# Altium schematic sheet Ethernet.SchDoc: Motor Vibration
size A4; Organization: NTUST EE-305; Address1: No.43, Sec. 4, Keelung Rd.; Address2: Da’an Dist.; Address3: Taipei 106; Address4: Taiwan (R.O.C.); DocumentNumber: 1; Revision: 3.0; SheetNumber: 2; SheetTotal: 9
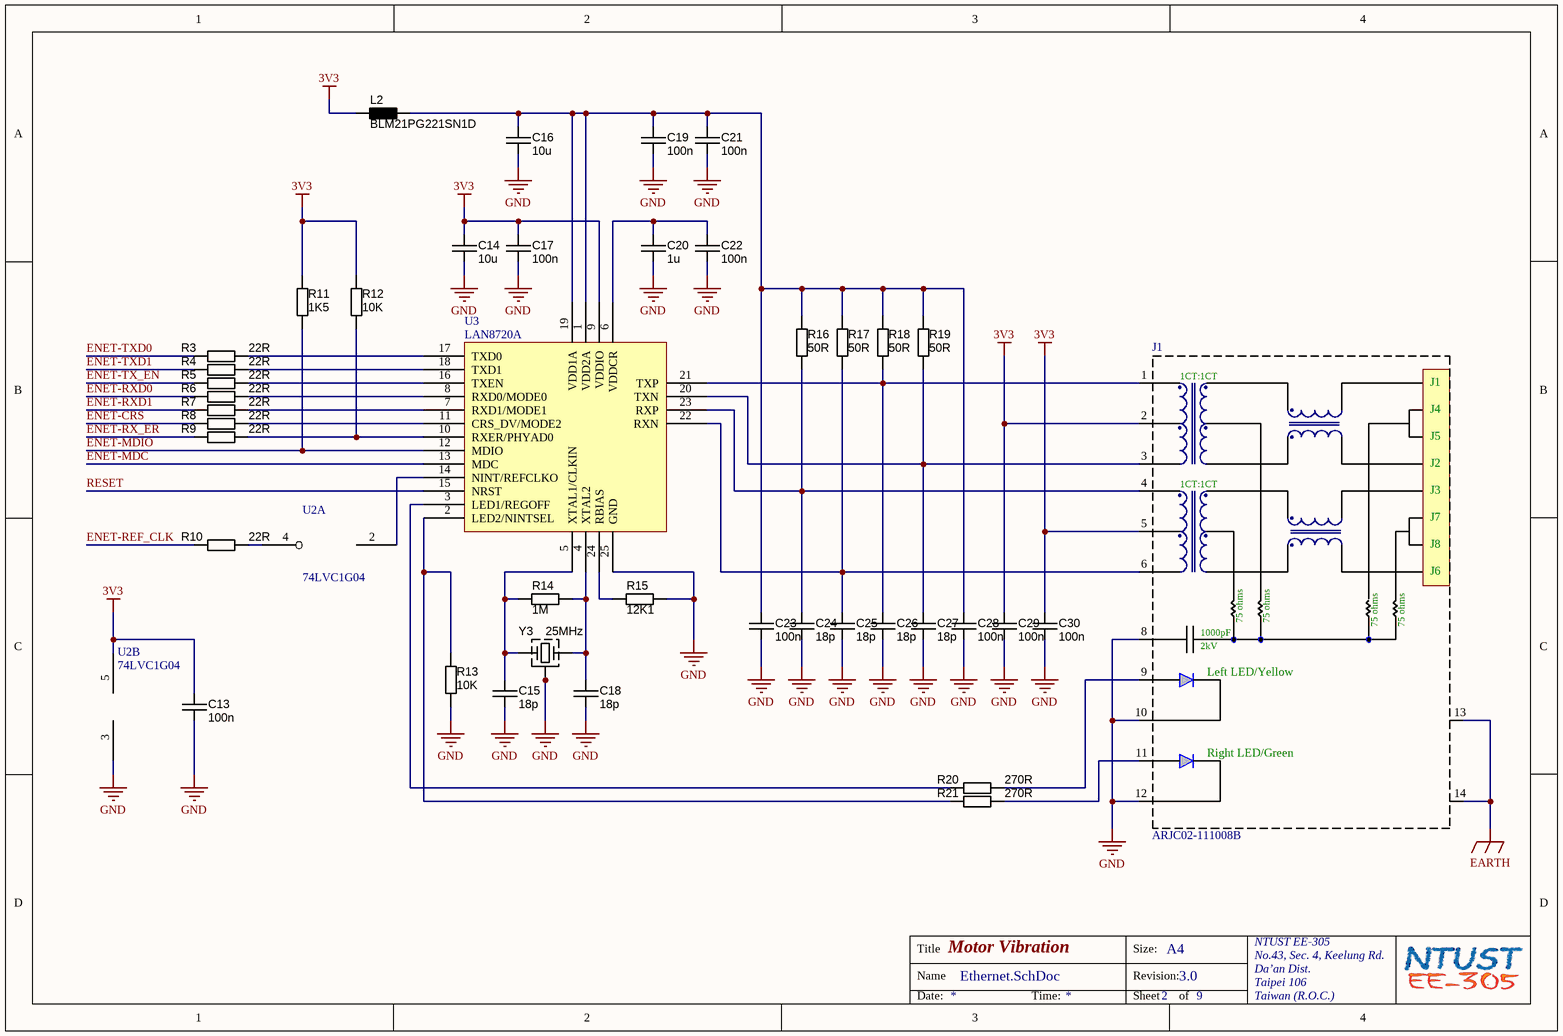
[diagram p0: Ethernet.SchDoc]

## Parts
C13  100n  [CAPC1005N]
C14  10u  [CAPC2012N]
C15  18p  [CAPC1005N]
C16  10u  [CAPC2012N]
C17  100n  [CAPC1005N]
C18  18p  [CAPC1005N]
C19  100n  [CAPC1005N]
C20  1u  [CAPC1608N]
C21  100n  [CAPC1005N]
C22  100n  [CAPC1005N]
C23  100n  [CAPC1005N]
C24  18p  [CAPC1005N]
C25  18p  [CAPC1005N]
C26  18p  [CAPC1005N]
C27  18p  [CAPC1005N]
C28  100n  [CAPC1005N]
C29  100n  [CAPC1005N]
C30  100n  [CAPC1005N]
J1  ARJC02-111008B  [ARJC02-111008B]
L2  BLM21PG221SN1D  [INDC2012N]
R3  22R  [RESC1005N]
R4  22R  [RESC1005N]
R5  22R  [RESC1005N]
R6  22R  [RESC1005N]
R7  22R  [RESC1005N]
R8  22R  [RESC1005N]
R9  22R  [RESC1005N]
R10  22R  [RESC1005N]
R11  1K5  [RESC1005N]
R12  10K  [RESC1005N]
R13  10K  [RESC1005N]
R14  1M  [RESC1005N]
R15  12K1  [RESC1005N]
R16  50R  [RESC1005N]
R17  50R  [RESC1005N]
R18  50R  [RESC1005N]
R19  50R  [RESC1005N]
R20  270R  [RESC1005N]
R21  270R  [RESC1005N]
U2  74LVC1G04  [SC70-LT5_N]  (parts A,B of 2)
U3  LAN8720A  [QFN-MJ24]
Y3  25MHz  [4SMD]

## Nets
3V3: C13.1 C14.1 C17.1 C29.1 C30.1 J1.2(CTD) J1.5(CRD) L2.1 R11.1 R12.1 U2.5(VCC) U3.9(VDDIO)
EARTH: J1.13(GND) J1.14(GND)
GND: C13.2 C14.2 C15.2 C16.2 C17.2 C18.2 C19.2 C20.2 C21.2 C22.2 C23.2 C24.2 C25.2 C26.2 C27.2 C28.2 C29.2 C30.2 J1.8(Shield) J1.10 J1.12 R13.2 R15.2 U2.3(GND) U3.25(GND) Y3.2(GND) Y3.4(GND)
ENET-CRS: R8.1
ENET-MDC: U3.13(MDC)
ENET-MDIO: R11.2 U3.12(MDIO)
ENET-REF_CLK: R10.1
ENET-RX_ER: R9.1
ENET-RXD0: R6.1
ENET-RXD1: R7.1
ENET-TX_EN: R5.1
ENET-TXD0: R3.1
ENET-TXD1: R4.1
RESET: U3.15(NRST)
NetC15_1: C15.1 R14.1 U3.5(XTAL1/CLKIN) Y3.1(X)
NetC16_1: C16.1 C19.1 C21.1 C23.1 C28.1 L2.2 R16.1 R17.1 R18.1 R19.1 U3.1(VDD2A) U3.19(VDD1A)
NetC18_1: C18.1 R14.2 U3.4(XTAL2) Y3.3(X)
NetC20_1: C20.1 C22.1 U3.6(VDDCR)
NetC24_1: C24.1 J1.4(RD+) R16.2 U3.23(RXP)
NetC25_1: C25.1 J1.6(RD-) R17.2 U3.22(RXN)
NetC26_1: C26.1 J1.1(TD+) R18.2 U3.21(TXP)
NetC27_1: C27.1 J1.3(TD-) R19.2 U3.20(TXN)
NetJ1_9: J1.9 R20.2
NetJ1_11: J1.11 R21.2
NetR3_2: R3.2 U3.17(TXD0)
NetR4_2: R4.2 U3.18(TXD1)
NetR5_2: R5.2 U3.16(TXEN)
NetR6_2: R6.2 U3.8(RXD0/MODE0)
NetR7_2: R7.2 U3.7(RXD1/MODE1)
NetR8_2: R8.2 U3.11(CRS_DV/MODE2)
NetR9_2: R9.2 R12.2 U3.10(RXER/PHYAD0)
NetR10_2: R10.2 U2.4
NetR13_1: R13.1 R21.1 U3.2(LED2/NINTSEL)
NetR15_1: R15.1 U3.24(RBIAS)
NetR20_1: R20.1 U3.3(LED1/REGOFF)
NetU2_2: U2.2 U3.14(NINT/REFCLKO)

## Notes on the sheet
- Title
- Name
- Size:
- Revision:
- A4
- Date:
- Time:
- Sheet
- of
- (in symbol ARJC02-111008B) 1CT:1CT; J4; J5; J2; J3; J7; J8; J6; 75 ohms; 1000pF; 2kV; Left LED/Yellow; Right LED/Green

## Library data of the parts
C13 C14 C16 C17 C19-C23 C28-C30 = Capacitor SMD Cer X7R: Manufacturer 1: Kemet; Manufacturer Part Number 1: C0805C104K5RACTU; Tolerance: ?0%; Ratings: 50V; X7R; Material: ceramic; Package / Case: 0805 (2012 metric); Supplier 1: Digi-Key; Supplier Part Number 1: 399-1170-1-ND
  C13 C17 C19 C21-C23 C28-C30: Value: 100n
  C14 C16: Value: 10u
  C20: Value: 1u
C15 C18 C24-C27 = Capacitor SMD Cer NPO: Manufacturer 1: Kemet; Manufacturer Part Number 1: C0805C104K5RACTU; Tolerance: ?0%; Ratings: 50V; X7R; Material: ceramic; Package / Case: 0805 (2012 metric); Supplier 1: Digi-Key; Supplier Part Number 1: 399-1170-1-ND; Value: 18p
J1 = ARJC02-111008B: 1 Port RJ45 Magjack Connector Through Hole 10/100 Base-TX, AutoMDIX; Supplier 1: Digi-Key; Supplier Part Number 1: 535-12605-ND
L2 = BLM21PG221SN1D: EMIFILr (Inductor type) Chip Ferrite Bead; Supplier 1: Digi-Key; Supplier Part Number 1: 490-1054-1-ND
R3-R21 = Resistor SMD chip: Manufacturer 1: Yageo; Manufacturer Part Number 1: RC0805JR-0710KL; Ratings: 1/8 W; Tolerance: ?%; Package / Case: 0805 (2012 metric); Material: Thick Film; Supplier 1: Digi-Key; Supplier Part Number 1: 311-10KARCT-ND
  R3-R10: Value: 22R
  R11: Value: 1K5
  R12 R13: Value: 10K
  R14: Value: 1M
  R15: Value: 12K1
  R16-R19: Value: 50R
  R20 R21: Value: 270R
U3 = Microchip LAN8720A: Small Footprint RMII 10/100 Ethernet  Transceiver with HP Auto-MDIX Support; Supplier 1: Digi-Key; Supplier Part Number 1: LAN8720A-CP-CT-ND
Y3 = CRYSTAL 25M: Oscillator Crystal; Supplier 1: Digi-Key; Supplier Part Number 1: 887-1099-1-ND